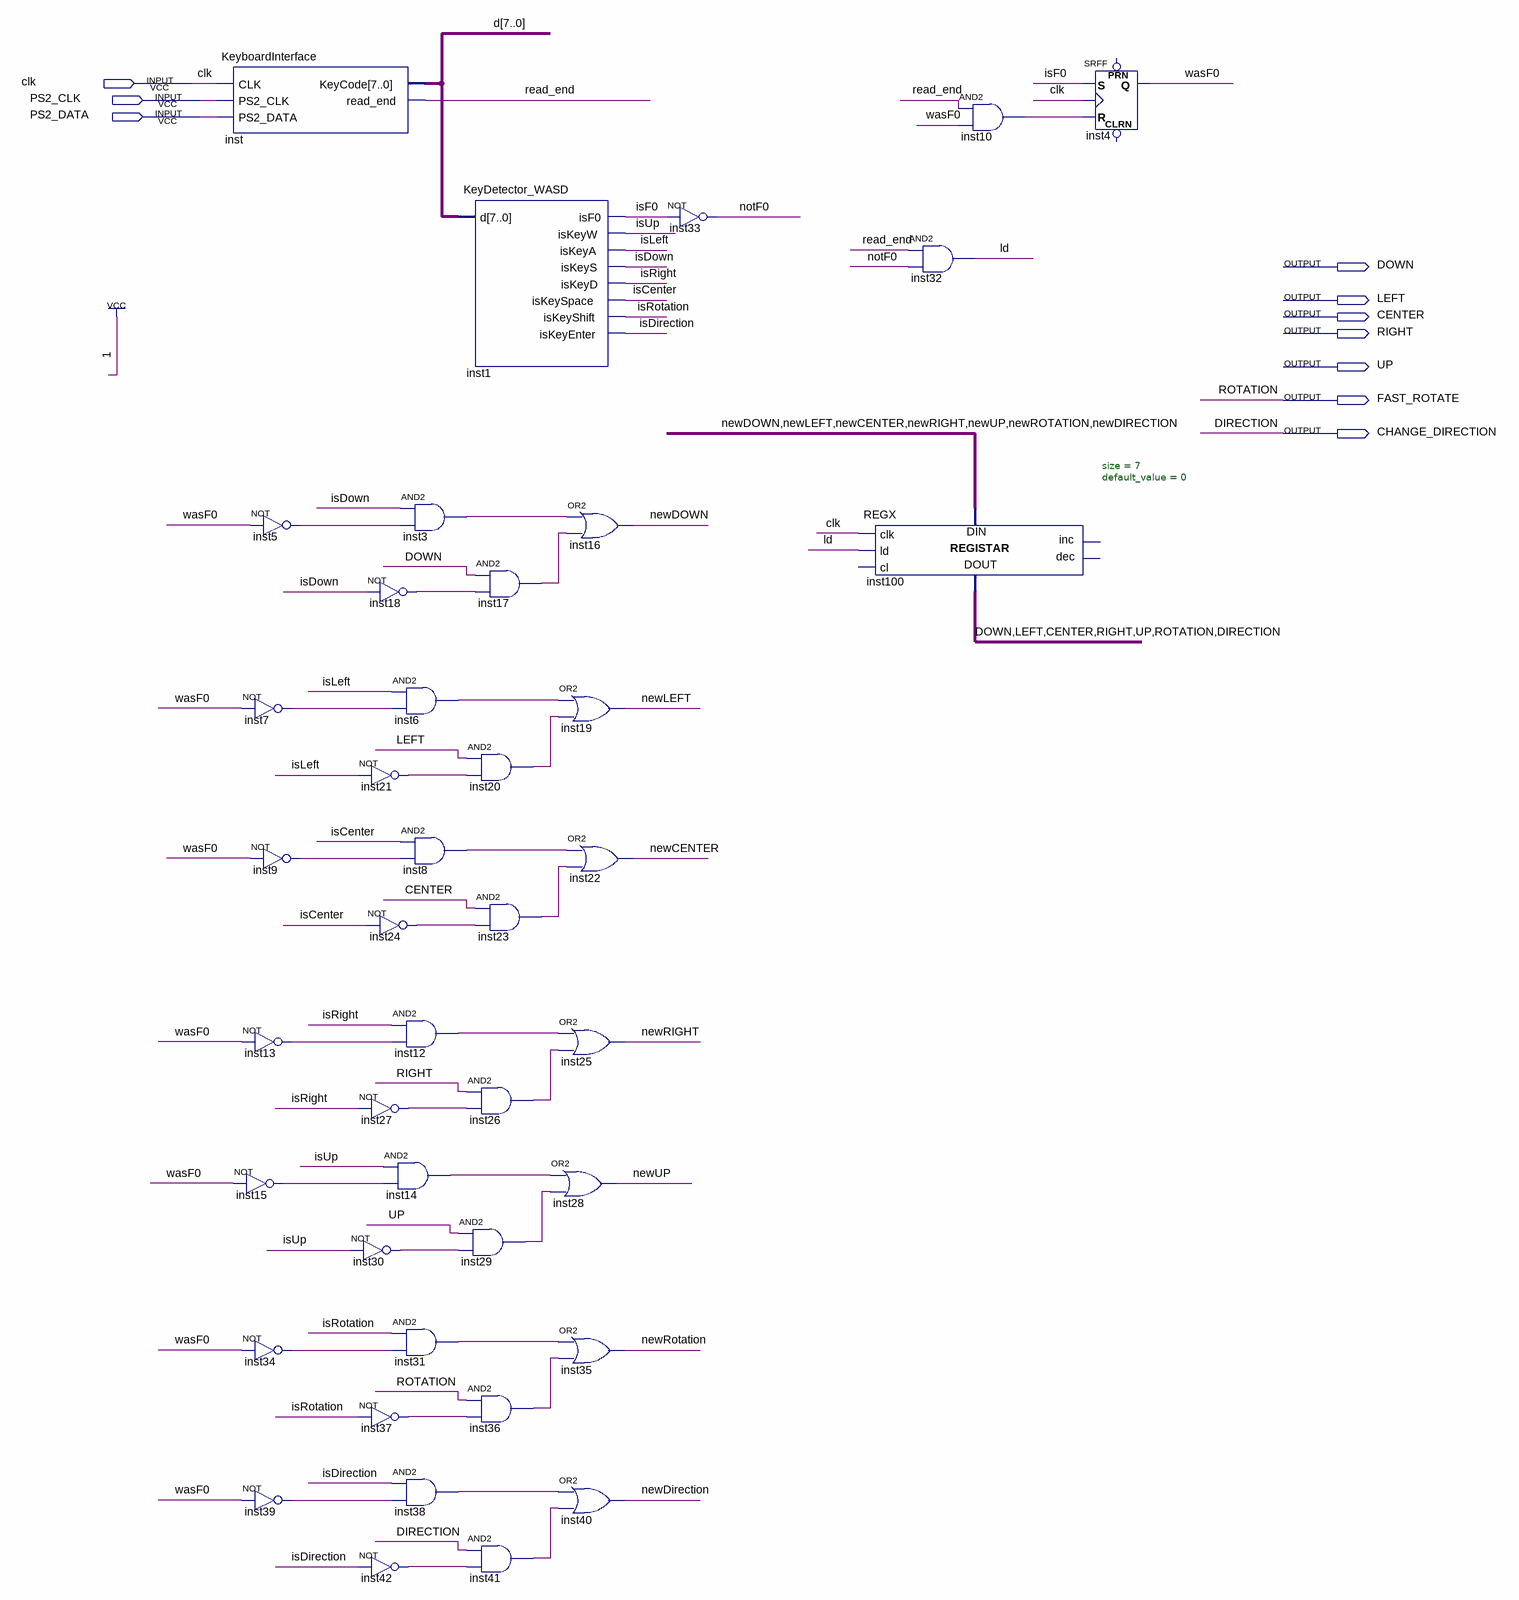
[diagram p0: schematic sheet]
// Quartus schematic keyMap_WASD.bdf as structural Verilog: 42 symbols, 10 pins
module keyMap_WASD (
  input  clk,
  input  PS2_CLK,
  input  PS2_DATA,
  output DOWN,
  output LEFT,
  output CENTER,
  output RIGHT,
  output UP,
  output FAST_ROTATE,
  output CHANGE_DIRECTION
);

  wire inst3_out, inst5_out, inst6_out, inst7_out, inst8_out, inst9_out, inst10_out, inst12_out, inst13_out,
       inst14_out, inst15_out, inst17_out, inst18_out, inst20_out, inst21_out, inst23_out, inst24_out,
       inst26_out, inst27_out, inst29_out, inst30_out, inst31_out, inst34_out, inst36_out, inst37_out,
       inst38_out, inst39_out, inst41_out, inst42_out, isCenter, isDirection, isDown, isF0, isLeft, isRight,
       isRotation, isUp, ld, newCENTER, newDirection, newDOWN, newLEFT, newRIGHT, newRotation, newUP, notF0,
       read_end, wasF0;
  wire [7:0] d;

  KeyboardInterface inst (.CLK(clk), .PS2_CLK(PS2_CLK), .PS2_DATA(PS2_DATA), .KeyCode(d), .read_end(read_end));
  not inst5 (inst5_out, wasF0);
  not inst7 (inst7_out, wasF0);
  not inst9 (inst9_out, wasF0);
  not inst13 (inst13_out, wasF0);
  not inst15 (inst15_out, wasF0);
  not inst34 (inst34_out, wasF0);
  not inst39 (inst39_out, wasF0);
  not inst18 (inst18_out, isDown);
  not inst21 (inst21_out, isLeft);
  not inst24 (inst24_out, isCenter);
  not inst27 (inst27_out, isRight);
  and inst14 (inst14_out, isUp, inst15_out);
  not inst30 (inst30_out, isUp);
  not inst37 (inst37_out, isRotation);
  not inst42 (inst42_out, isDirection);
  and inst3 (inst3_out, isDown, inst5_out);
  and inst6 (inst6_out, isLeft, inst7_out);
  and inst8 (inst8_out, isCenter, inst9_out);
  and inst12 (inst12_out, isRight, inst13_out);
  and inst31 (inst31_out, isRotation, inst34_out);
  and inst38 (inst38_out, isDirection, inst39_out);
  KeyDetector_WASD inst1 (
    .d(d), .isF0(isF0), .isKeyW(isUp), .isKeyA(isLeft), .isKeyS(isDown), .isKeyD(isRight),
    .isKeySpace(isCenter), .isKeyShift(isRotation), .isKeyEnter(isDirection));
  and inst17 (inst17_out, DOWN, inst18_out);
  and inst20 (inst20_out, LEFT, inst21_out);
  and inst23 (inst23_out, CENTER, inst24_out);
  and inst26 (inst26_out, RIGHT, inst27_out);
  and inst29 (inst29_out, UP, inst30_out);
  and inst36 (inst36_out, FAST_ROTATE, inst37_out);
  and inst41 (inst41_out, CHANGE_DIRECTION, inst42_out);
  or inst16 (newDOWN, inst3_out, inst17_out);
  or inst19 (newLEFT, inst6_out, inst20_out);
  or inst22 (newCENTER, inst8_out, inst23_out);
  or inst25 (newRIGHT, inst12_out, inst26_out);
  or inst28 (newUP, inst14_out, inst29_out);
  or inst35 (newRotation, inst31_out, inst36_out);
  or inst40 (newDirection, inst38_out, inst41_out);
  not inst33 (notF0, isF0);
  and inst32 (ld, read_end, notF0);
  REGX #(.size(7), .default_value(0)) inst100 (
    .clk(clk), .ld(ld), .data_in({newDOWN, newLEFT, newCENTER, newRIGHT, newUP, newRotation, newDirection}),
    .data_out({DOWN, LEFT, CENTER, RIGHT, UP, FAST_ROTATE, CHANGE_DIRECTION}));  // open: cl, inc, dec
  and inst10 (inst10_out, read_end, wasF0);
  SRFF inst4 (.S(isF0), .R(inst10_out), .CLK(clk), .Q(wasF0));  // open: PRN, CLRN

  // Other names for the same wires on the sheet: DIRECTION = CHANGE_DIRECTION; ROTATION = FAST_ROTATE
endmodule
